# EAGLE design Base_Station (EAGLE 9.6.2)
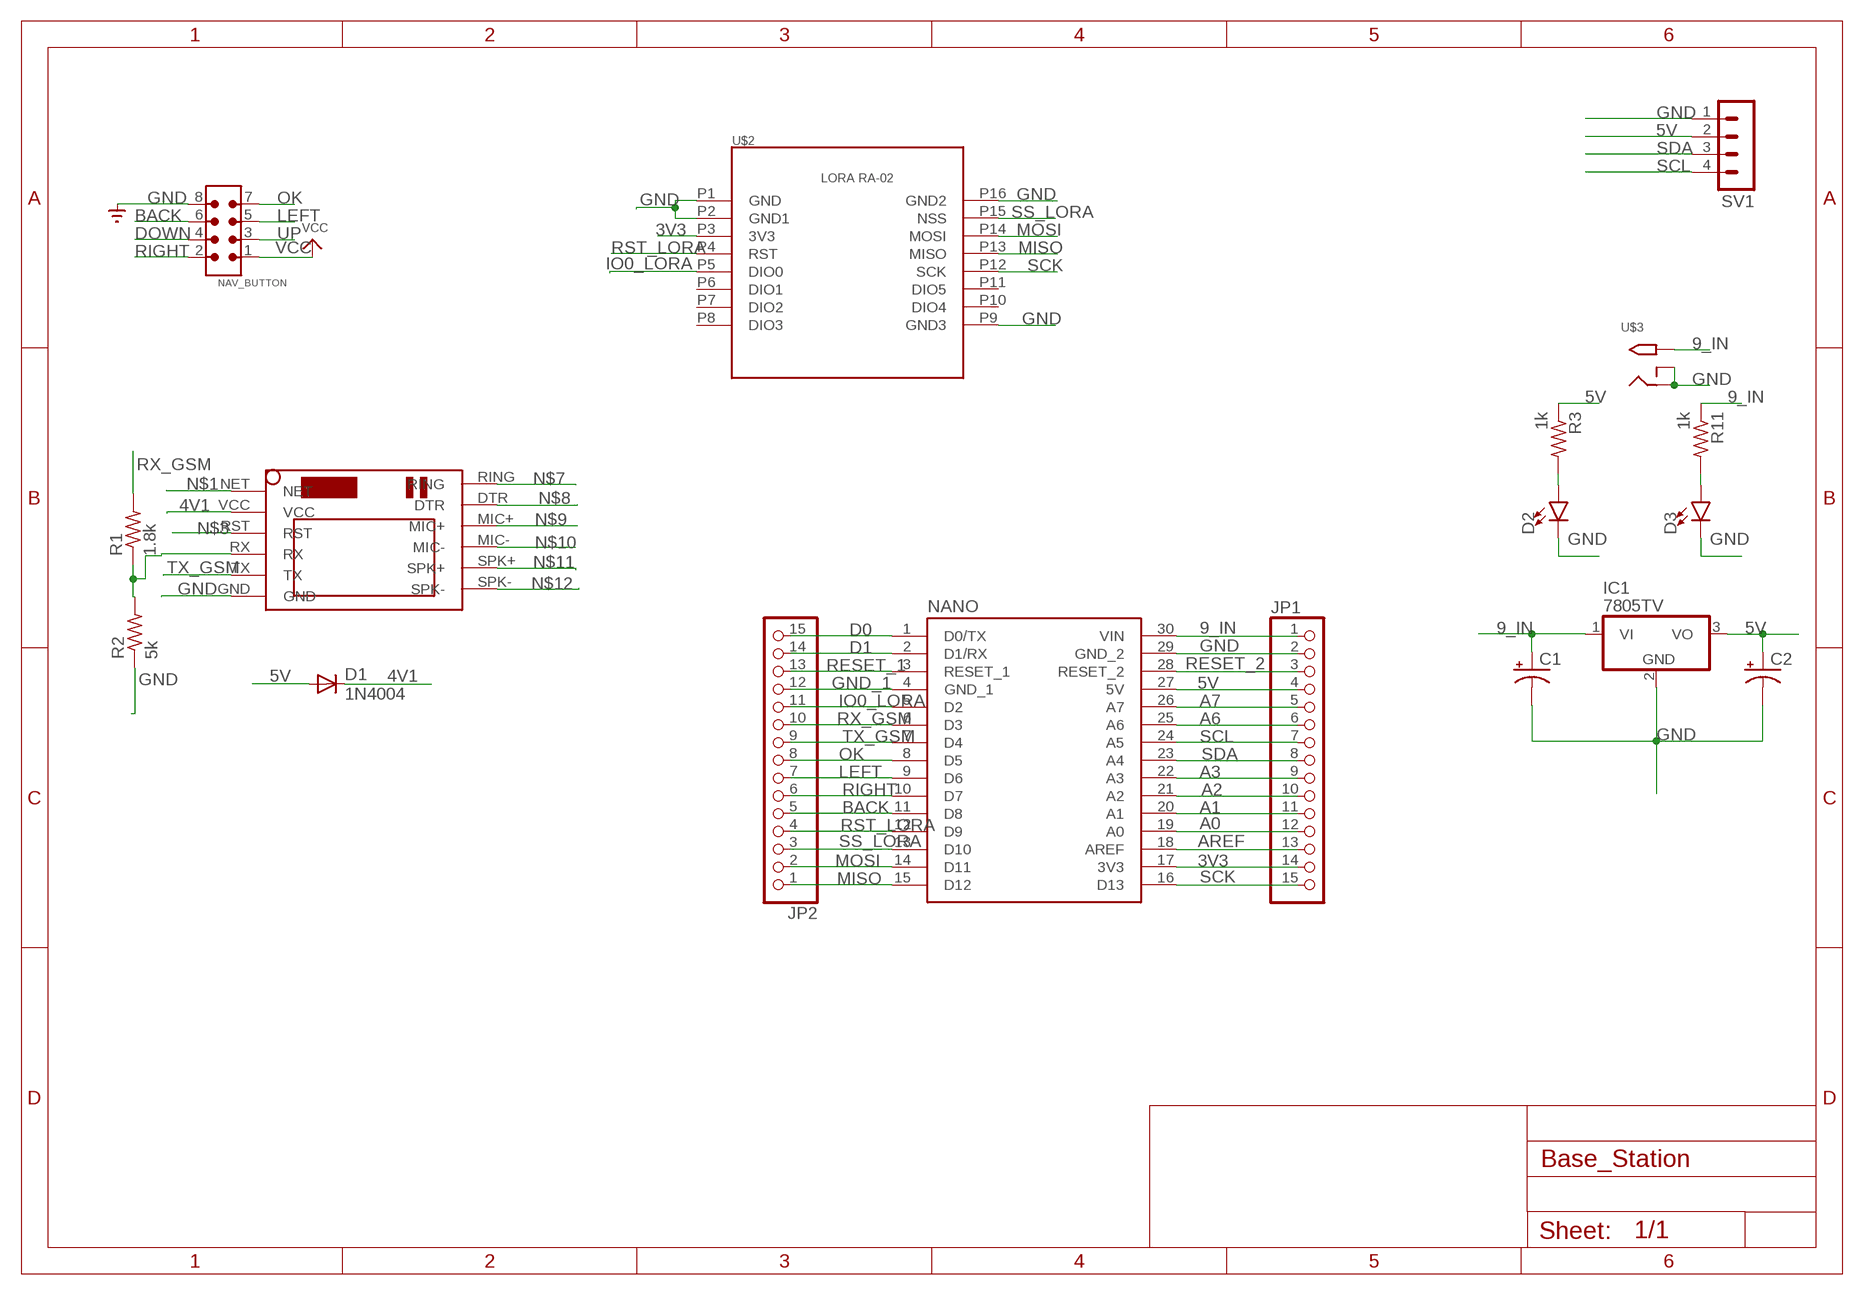
[diagram p0: schematic, sheet 1]

## Parts
C1  CPOL-USE3.5-8  [E3,5-8]
C2  CPOL-USE3.5-8  [E3,5-8]
D1  1N4004  [DO41-10]
D2  LED3MM  [LED_3MM]
D3  LED3MM  [LED_3MM]
IC1  7805TV  [TO220V]
JP1  PINHD-1X15  [1X15]
JP2  PINHD-1X15  [1X15]
NANO  A000005  [MODULE_A000005]
NAV_BUTTON  6120XX21621_61200821621  [61200821621]
R1  1.8k  FLIPFLOP-RES  [0805-THM]
R2  5k  FLIPFLOP-RES  [0805-THM]
R3  1k  R-US_M0805  [M0805]
R11  1k  R-US_M0805  [M0805]
SV1  MA04-1  [MA04-1]
U$1  SIM800LMODULE  [SIM800LMODULE]
U$2  LORA_RA-02  [RA-02]
U$3  2.1MMJACKTHM  [PJ-102A]

## Nets
3V3: JP1.14 NANO.17(3V3) U$2.P3(3V3)
4V1: D1.C U$1.VCC
5V: C2.+ D1.A IC1.3(VO) JP1.4 NANO.27(5V) R3.1 SV1.2
9_IN: C1.+ IC1.1(VI) JP1.1 NANO.30(VIN) R11.1 U$3.TIP
A0: JP1.12 NANO.19(A0)
A1: JP1.11 NANO.20(A1)
A2: JP1.10 NANO.21(A2)
A3: JP1.9 NANO.22(A3)
A6: JP1.6 NANO.25(A6)
A7: JP1.5 NANO.26(A7)
AREF: JP1.13 NANO.18(AREF)
BACK: JP2.5 NANO.11(D8) NAV_BUTTON.6
D0: JP2.15 NANO.1(D0/TX)
D1: JP2.14 NANO.2(D1/RX)
DOWN: NAV_BUTTON.4
GND: C1.- C2.- D2.K(C) D3.K(C) IC1.2(GND) JP1.2 NANO.29(GND_2) NAV_BUTTON.8 R2.1 SV1.1 U$1.GND U$2.P1(GND) U$2.P2(GND1) U$2.P9(GND3) U$2.P16(GND2) U$3.RING U$3.RING_SW ; supply symbol labelled SUPPLY0_GND_
GND_1: JP2.12 NANO.4(GND_1)
IO0_LORA: JP2.11 NANO.5(D2) U$2.P5(DIO0)
LEFT: JP2.7 NANO.9(D6) NAV_BUTTON.5
MISO: JP2.1 NANO.15(D12) U$2.P13(MISO)
MOSI: JP2.2 NANO.14(D11) U$2.P14(MOSI)
N$1: U$1.NET
N$2: D3.A R11.2
N$3: U$1.RST
N$4: R1.1 R2.2 U$1.RX
N$5: D2.A R3.2
N$7: U$1.RING
N$8: U$1.DTR
N$9: U$1.MIC+
N$10: U$1.MIC-
N$11: U$1.SPK+
N$12: U$1.SPK-
OK: JP2.8 NANO.8(D5) NAV_BUTTON.7
RESET_1: JP2.13 NANO.3(RESET_1)
RESET_2: JP1.3 NANO.28(RESET_2)
RIGHT: JP2.6 NANO.10(D7) NAV_BUTTON.2
RST_LORA: JP2.4 NANO.12(D9) U$2.P4(RST)
RX_GSM: JP2.10 NANO.6(D3) R1.2
SCK: JP1.15 NANO.16(D13) U$2.P12(SCK)
SCL: JP1.7 NANO.24(A5) SV1.4
SDA: JP1.8 NANO.23(A4) SV1.3
SS_LORA: JP2.3 NANO.13(D10) U$2.P15(NSS)
TX_GSM: JP2.9 NANO.7(D4) U$1.TX
UP: NAV_BUTTON.3
VCC: NAV_BUTTON.1
Unconnected: U$2.P6(DIO1) U$2.P7(DIO2) U$2.P8(DIO3) U$2.P10(DIO4) U$2.P11(DIO5)

## Library data of the parts
C1 C2 = adafruit:CPOL-US: POLARIZED CAPACITOR, American symbol
D1 = adafruit:1N4004: DIODE General purpose 1N400x type rectifier (With bigger pads) http://www.ladyada.net/library/pcb/eaglelibrary.html
D2 D3 = SparkFun-LED:LED: LED (Generic) Standard schematic elements and footprints for 5mm, 3mm, 1206, and 0603 sized LEDs. Generic LEDs with no color specified.; PROD_ID: DIO-08794
IC1 = linear:78*: Positive VOLTAGE REGULATOR Source: http://cache.national.com/ds/LM/LM78L05.pdf http://www.fairchildsemi.com/ds/LM/LM7805.pdf
JP1 JP2 = adafruit:PINHD-1X15: PIN HEADER
NANO = A000005:A000005: CLOCK SAW OSCILLATOR SEAM7050 T& Check prices <https://pricing.snapeda.com/parts/A000005/Arduino/view-part?ref=eda>; AVAILABILITY: Good; DESCRIPTION: ATmega328 Arduino Nano AVR® ATmega AVR MCU 8-Bit Embedded Evaluation Board; MF: Arduino; MP: A000005; PACKAGE: None; PRICE: None; PURCHASE-URL: https://pricing.snapeda.com/search/part/A000005/?ref=eda
NAV_BUTTON = Wurth_Connectors_WR-BHD:6120XX21621_61200821621: WR-BHD 2.54 mm Male Box Header KIND PROPERTIES: Pitch 2.54 mm Gender:Male MATERIAL PROPERTIES: Insulator Material:PBT Insulator Flammability Rating UL94 V-0 Insulator Color:Black Contact Material :Copper Alloy Contact Plating :Gold Contact Type: Stamped GENERAL INFORMATION: Operating Temperature:-40 °C up to +125 °C Compliance:RoHS Working Voltage: 250 V (AC) Withstanding Voltage:500 V (AC) Contact Resistance: 20 mΩ Insulation Resistance:1000 MΩ CERTIFICATION: UL Approval:E323964 PACKAGING PROPERTIES Packaging :Tray <https://katalog.we-online.com/media/images/v2/o32884v209%20Family_WR-BHD_6120xx21621.jpg> Details see: https://katalog.we-online.com/en/em/BHD_2_54_MALE_BOX_HEADER_6120XX21621 Updated by Yingchun,Shan 2019-10-29 2019 (C) Würth Elektronik; CONTACT-RESISTANCE: 20mOhm; DATASHEET-URL: https://katalog.we-online.com/em/datasheet/61200821621.pdf; GENDER: Male; IR: 3A; L: 17.82mm; MATES: WR-BHD 2.54mm Female IDC Connector with Strain Relief; MOUNT: THT; PACKAGING: Tray; PART-NUMBER: 61200821621; PINS: 8; PITCH: 2.54mm; TOL-R: max.; TYPE: Straight; WORKING-VOLTAGE: 250V(AC)
R1 R2 = adafruit:FLIPFLOP-RES: Flip Flop resistor An 0805 resistor inside a standard 1/4W 5% resistor. Makes for easy mods
R3 R11 = adafruit:R-US_: RESISTOR, American symbol
SV1 = con-lstb:MA04-1: PIN HEADER; OC_FARNELL: unknown; OC_NEWARK: unknown
U$1 = SIM800LMODULE:SIM800LMODULE: SIM800L Module
U$2 = LORA RA-02:LORA_RA-02
U$3 = adafruit:2.1MMJACK: 2.1mm x 5.5mm THM DC jack with internal switch. Digikey part #PJ-102A, 4UCON part #05537 2.1mm x 5.5mm SMT DC jack with internal switch. Digikey part #PJ-002A-SMT, 4UCON part #03267 By microbuilder.eu & adafruit.com

## Module LORA
Ports: 

### Library data of the parts

## Board
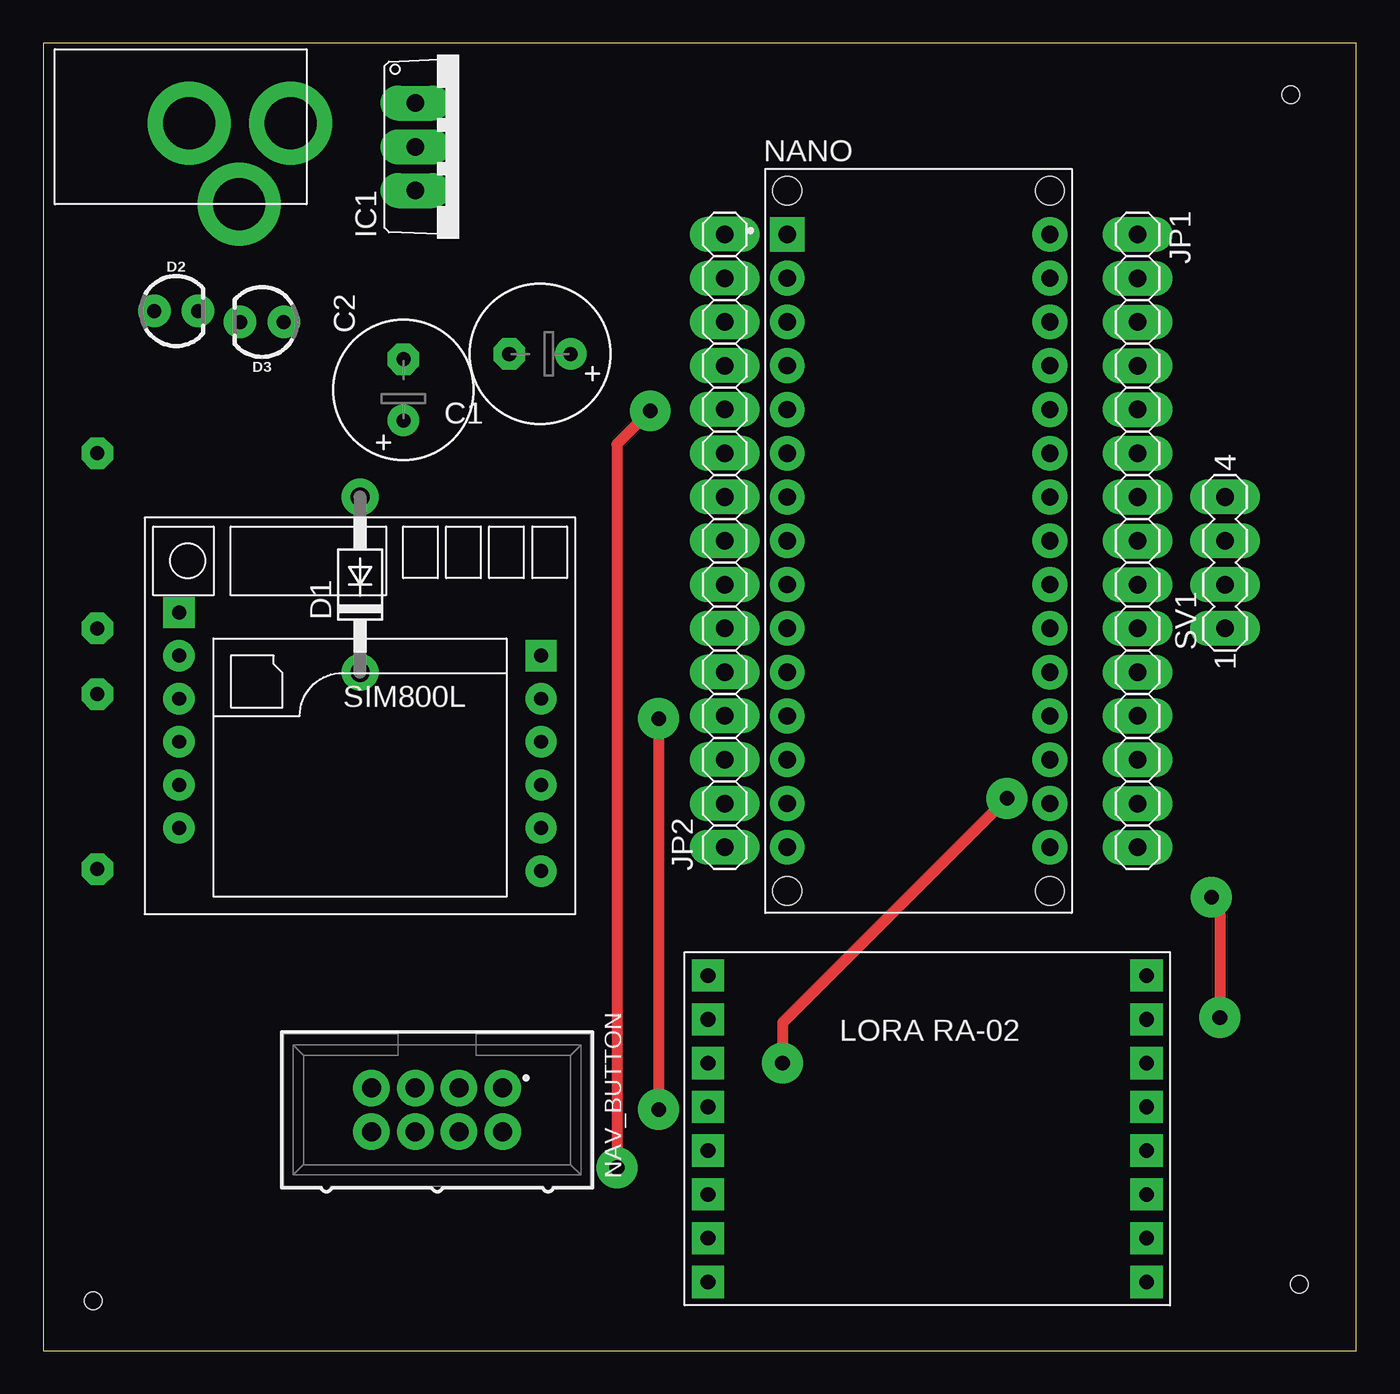
[diagram p1: board, top side]
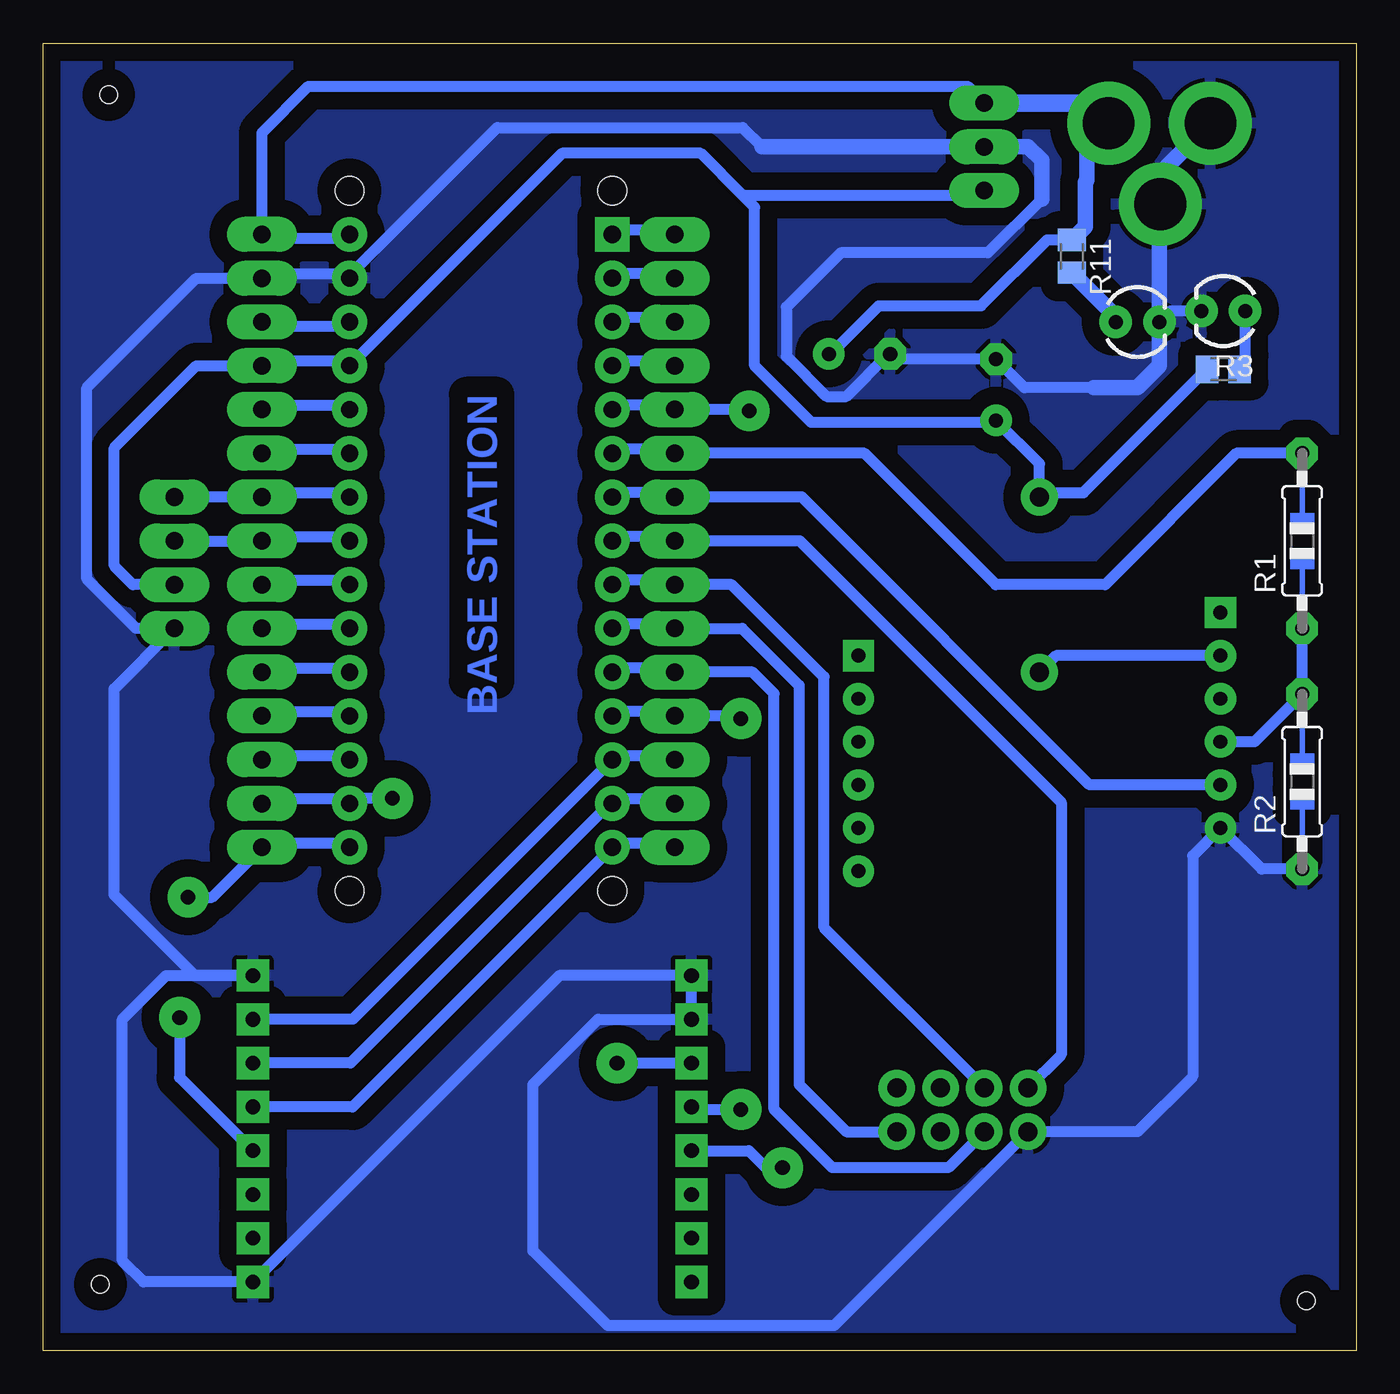
[diagram p2: board, bottom side, seen from below]

Size 76.2 x 75.87 mm. Coordinates in mm from the lower left corner, seen from the top.
Outline: 0,0 76.2,0 76.2,75.87 0,75.87 0,0
Copper layers (1*16): Top 0.035mm / dielectric 1.5mm / Bottom 0.035mm
Design rules "normal_fab *": minimum track width 25mil, minimum drill 0.85mm, track to track 15mil, track to pad 15mil, pad to pad 15mil, via to via 15mil, smd to smd 15mil, copper to edge 40mil, drill to drill 6mil, minimum pad ring 20mil, minimum via ring 30mil, stop-mask expansion 4mil, vias tented up to drill 0mil, thermal gap 10mil
Holes 1 mm at 2.9,2.9 72.39,72.87 72.87,3.86

### Footprints (pad centres in the part's own frame; a part is rotated, then mirrored left to right if it is on the bottom)
E3,5-8 = drill 0.813 pad 1.6: + -1.778,0 | drill 0.813 pad 1.6 octagon: - 1.778,0
DO41-10 = drill 1.118 pad 1.93: A 5.08,0; C -5.08,0
LED_3MM = drill 0.813 pad 1.88: A -1.27,0; K 1.27,0
TO220V = drill 1.016 long: 1 -2.54,-2.54; 2 0,-2.54; 3 2.54,-2.54
1X15 = drill 1.016 long: 1 -17.78,0; 2 -15.24,0; 3 -12.7,0; 4 -10.16,0; 5 -7.62,0; 6 -5.08,0; 7 -2.54,0; 8 0,0; 9 2.54,0; 10 5.08,0; 11 7.62,0; 12 10.16,0; 13 12.7,0; 14 15.24,0; 15 17.78,0
MODULE_A000005 = drill 1 square: 1 -7.62,17.78 | drill 1: 2 -7.62,15.24; 3 -7.62,12.7; 4 -7.62,10.16; 5 -7.62,7.62; 6 -7.62,5.08; 7 -7.62,2.54; 8 -7.62,0; 9 -7.62,-2.54; 10 -7.62,-5.08; 11 -7.62,-7.62; 12 -7.62,-10.16; 13 -7.62,-12.7; 14 -7.62,-15.24; 15 -7.62,-17.78; 16 7.62,-17.78; 17 7.62,-15.24; 18 7.62,-12.7; 19 7.62,-10.16; 20 7.62,-7.62; 21 7.62,-5.08; 22 7.62,-2.54; 23 7.62,0; 24 7.62,2.54; 25 7.62,5.08; 26 7.62,7.62; 27 7.62,10.16; 28 7.62,12.7; 29 7.62,15.24; 30 7.62,17.78 | hole 1.651: -7.62,-20.32; 7.62,-20.32; -7.62,20.32; 7.62,20.32
61200821621 = drill 1.1: 1 -3.81,-1.27; 2 -3.81,1.27; 3 -1.27,-1.27; 4 -1.27,1.27; 5 1.27,-1.27; 6 1.27,1.27; 7 3.81,-1.27; 8 3.81,1.27
0805-THM = drill 0.813 pad 1.676 octagon: 1 -5.08,0; 2 5.08,0
M0805 = smd 1.3 x 1.6: 1 -0.95,0; 2 0.95,0
MA04-1 = drill 1.016 long: 1 -3.81,0; 2 -1.27,0; 3 1.27,0; 4 3.81,0
SIM800LMODULE = drill 0.8: DTR 10.5,1; GND -10.5,-6.5; MIC+ 10.5,-1.5; MIC- 10.5,-4; RST -10.5,1; RX -10.5,-1.5; SPK+ 10.5,-6.5; SPK- 10.5,-9; TX -10.5,-4; VCC -10.5,3.5 | drill 0.8 square: NET -10.5,6; RING 10.5,3.5
RA-02 = drill 0.85 square: P1 0,0; P2 0,-2.54; P3 0,-5.08; P4 0,-7.62; P5 0,-10.16; P6 0,-12.7; P7 0,-15.24; P8 0,-17.78; P9 25.44,-17.78; P10 25.44,-15.24; P11 25.44,-12.7; P12 25.44,-10.16; P13 25.44,-7.62; P14 25.44,-5.08; P15 25.44,-2.54; P16 25.44,0
PJ-102A = drill 3 pad 4.8: RING 0.1,-3.39; RING_SW -4.6,-6.29; TIP 0.1,-9.29

### Placement (x,y rotation side)
C1  28.83,57.84 180 top
C2  20.9,55.75 90 top
D1  18.39,44.45 90 top
D2  7.72,60.33 0 top
D3  12.7,59.69 180 top
IC1  24.13,69.85 270 top
JP1  63.5,46.99 270 top
JP2  39.55,46.99 90 top
NANO  50.8,46.99 0 top
NAV_BUTTON  22.86,13.97 180 top
R1  3.15,46.99 90 bottom
R2  3.15,33.02 90 bottom
R3  7.72,56.95 0 bottom
R11  16.51,63.5 270 bottom
SV1  68.58,45.72 90 top
U$1  18.39,36.83 0 top
U$2  38.58,21.77 0 top
U$3  5.08,71.12 90 top

### Tracks (layer width: path | path; a pad name or v marks a point on that pad's centre or on a via)
3V3  (via drill 0.85)
  Top 0.635: v55.93,32.05 42.9,19.02 v42.9,16.69
  Bottom 0.635: v42.9,16.69 U$2.P3 | v55.93,32.05 58.12,32.05 NANO.17 58.42,32 63.5,32 JP1.14
4V1
  Bottom 0.635: U$1.VCC 17.43,40.33 D1.C
5V
  Bottom 0.635: SV1.2 70.99,44.45 72.07,45.53 72.07,52.39 67.31,57.15 JP1.4 63.5,57.4 58.42,57.4 NANO.27 46.1,69.47 38.04,69.47 35.59,67.02 | 35.59,67.02 34.91,66.34 34.91,57.15 31.63,53.87 21.01,53.87 C2.+ 18.39,51.46 D1.A 18.29,49.78 15.83,49.78 R3.1 | IC1.3 21.84,67.06 35.56,67.06 35.59,67.02
9_IN
  Bottom 0.635: 15.74,67.8 15.64,67.9 | NANO.30 58.65,64.54 63.27,64.54 JP1.1 63.5,70.66 60.81,73.36 22.55,73.36 IC1.1 21.84,72.64 | R11.1 17.96,64.45 21.78,60.63 27.71,60.63 30.43,57.91 30.48,57.91 C1.+
  Bottom 0.889: R11.1 15.74,65.22 15.74,67.8 | U$3.TIP 15.64,69.95 15.64,67.9
  Bottom 1.016: U$3.TIP 15.54,72.39 IC1.1
A0
  Bottom 0.635: NANO.19 58.42,37.08 63.5,37.08 JP1.12
A1
  Bottom 0.635: NANO.20 58.42,39.62 63.5,39.62 JP1.11
A2
  Bottom 0.635: NANO.21 58.42,42.16 63.5,42.16 JP1.10
A3
  Bottom 0.635: NANO.22 58.42,44.7 63.5,44.7 JP1.9
A6
  Bottom 0.635: NANO.25 58.42,52.32 63.5,52.32 JP1.6
A7
  Bottom 0.635: NANO.26 58.42,54.86 63.5,54.86 JP1.5
AREF
  Bottom 0.635: NANO.18 58.42,34.54 63.5,34.54 JP1.13
BACK
  Bottom 0.635: NAV_BUTTON.6 23.67,10.62 30.4,10.62 33.78,13.99 33.78,38.12 35.03,39.37 JP2.5 39.62,39.62 43.18,39.62 NANO.11
D0
  Bottom 0.635: NANO.1 43.18,65.02 39.62,65.02 JP2.15
D1
  Bottom 0.635: NANO.2 43.18,62.48 39.62,62.48 JP2.14
GND
  Bottom 0.635: U$3.RING_SW 11.43,66.46 | R2.1 5.5,27.94 U$1.GND 9.5,28.72 9.5,15.9 12.7,12.7 NAV_BUTTON.8 30.3,1.45 43.43,1.45 47.78,5.79 47.78,15.44 43.99,19.23 U$2.P2 U$2.P1 46.24,21.77 U$2.P9 70.37,3.99 71.6,5.22 71.6,19.23 69.06,21.77 U$2.P16 67.4,21.77 72.08,26.45 72.08,38.41 SV1.1 70.8,41.91 73.66,44.77 73.66,55.88 67.31,62.23 JP1.2 63.25,62.48 58.67,62.48 NANO.29 58.42,62.4 49.85,70.97 35.61,70.97 34.49,69.85 | 18.26,66.83 21.39,63.7 29.92,63.7 33.07,60.55 33.07,57.7 30.75,55.37 29.6,55.37 27.14,57.84 C1.- 26.75,57.53 C2.- 19.25,55.88 15.24,55.88 | D2.K 10.79,60.33 D3.K
  Bottom 0.889: 34.49,69.85 IC1.2 19.05,69.85 18.26,69.06 18.26,66.83 | U$3.RING 11.37,68.32 U$3.RING_SW | 11.43,66.46 D3.K 11.43,57.15 12.7,55.88 15.24,55.88
  pour Bottom (isolate 1.016): 0,75.77 0,0 76.25,0 76.25,75.77 arc4
GND_1
  Bottom 0.635: NANO.4 43.18,57.4 39.62,57.4 JP2.12
IO0_LORA  (via drill 0.85)
  Top 0.635: v35.23,54.53 33.3,52.6 v33.3,10.62
  Bottom 0.635: U$2.P5 35.26,11.61 34.27,10.62 v33.3,10.62 | v35.23,54.53 35.31,54.61 JP2.11 39.62,54.86 43.18,54.86 NANO.5
LEFT
  Bottom 0.635: NAV_BUTTON.5 30.89,24.54 30.89,39.09 36.25,44.45 JP2.7 39.62,44.7 43.18,44.7 NANO.9
MISO
  Bottom 0.635: U$2.P13 58.24,14.15 NANO.15 43.18,29.46 39.62,29.46 JP2.1
MOSI
  Bottom 0.635: U$2.P14 64.01,16.76 63.98,16.69 58.37,16.69 43.31,31.75 NANO.14 43.18,32 39.62,32 JP2.2
N$2
  Bottom 0.635: D3.A 13.97,60.01
  Bottom 0.889: R11.2 13.97,60.01
N$4
  Bottom 0.635: U$1.RX 5.92,35.33 R2.2 R1.1
N$5
  Bottom 0.635: R3.2 6.45,57.27 D2.A
OK
  Bottom 0.635: NAV_BUTTON.7 17.12,17.17 17.12,31.82 32.29,46.99 JP2.8 39.62,47.24 43.18,47.24 NANO.8
RESET_1
  Bottom 0.635: NANO.3 43.18,59.94 39.62,59.94 JP2.13
RESET_2
  Bottom 0.635: NANO.28 58.65,59.46 63.27,59.46 JP1.3
RIGHT
  Bottom 0.635: NAV_BUTTON.2 29.59,12.7 32.33,15.44 32.33,38.61 35.64,41.91 JP2.6 39.62,42.16 43.18,42.16 NANO.10
RST_LORA  (via drill 0.85)
  Top 0.635: v35.71,36.68 v35.71,13.99
  Bottom 0.635: U$2.P4 38.43,13.99 v35.71,13.99 | v35.71,36.68 35.87,36.83 JP2.4 39.62,37.08 43.18,37.08 NANO.12
RX_GSM
  Bottom 0.635: R1.2 6.96,52.07 14.58,44.45 20.93,44.45 28.55,52.07 JP2.10 39.62,52.32 43.18,52.32 NANO.6
SCK  (via drill 0.85)
  Top 0.635: v67.79,26.31 68.28,25.83 v68.28,19.33
  Bottom 0.635: v68.28,19.33 68.28,15.86 U$2.P12 | v67.79,26.31 66.4,26.31 JP1.15 63.5,29.46 58.42,29.46 NANO.16
SCL
  Bottom 0.635: SV1.4 JP1.7 63.5,49.78 58.42,49.78 NANO.24
SDA
  Bottom 0.635: SV1.3 JP1.8 63.5,47.24 58.42,47.24 NANO.23
SS_LORA
  Bottom 0.635: U$2.P15 58.23,19.23 NANO.13 43.18,34.54 39.62,34.54 JP2.3
TX_GSM
  Bottom 0.635: U$1.TX 15.48,32.83 32.18,49.53 JP2.9 39.62,49.78 43.18,49.78 NANO.7

### Text on the board
Bottom: BASE STATION